# EasyEDA schematic OCC test LM339.json
TITLE: Sheet_1; REV: 1.0; Date: 2024-12-10; Sheet: 1/1; Drawn By: helmut-f; Company: Your Company
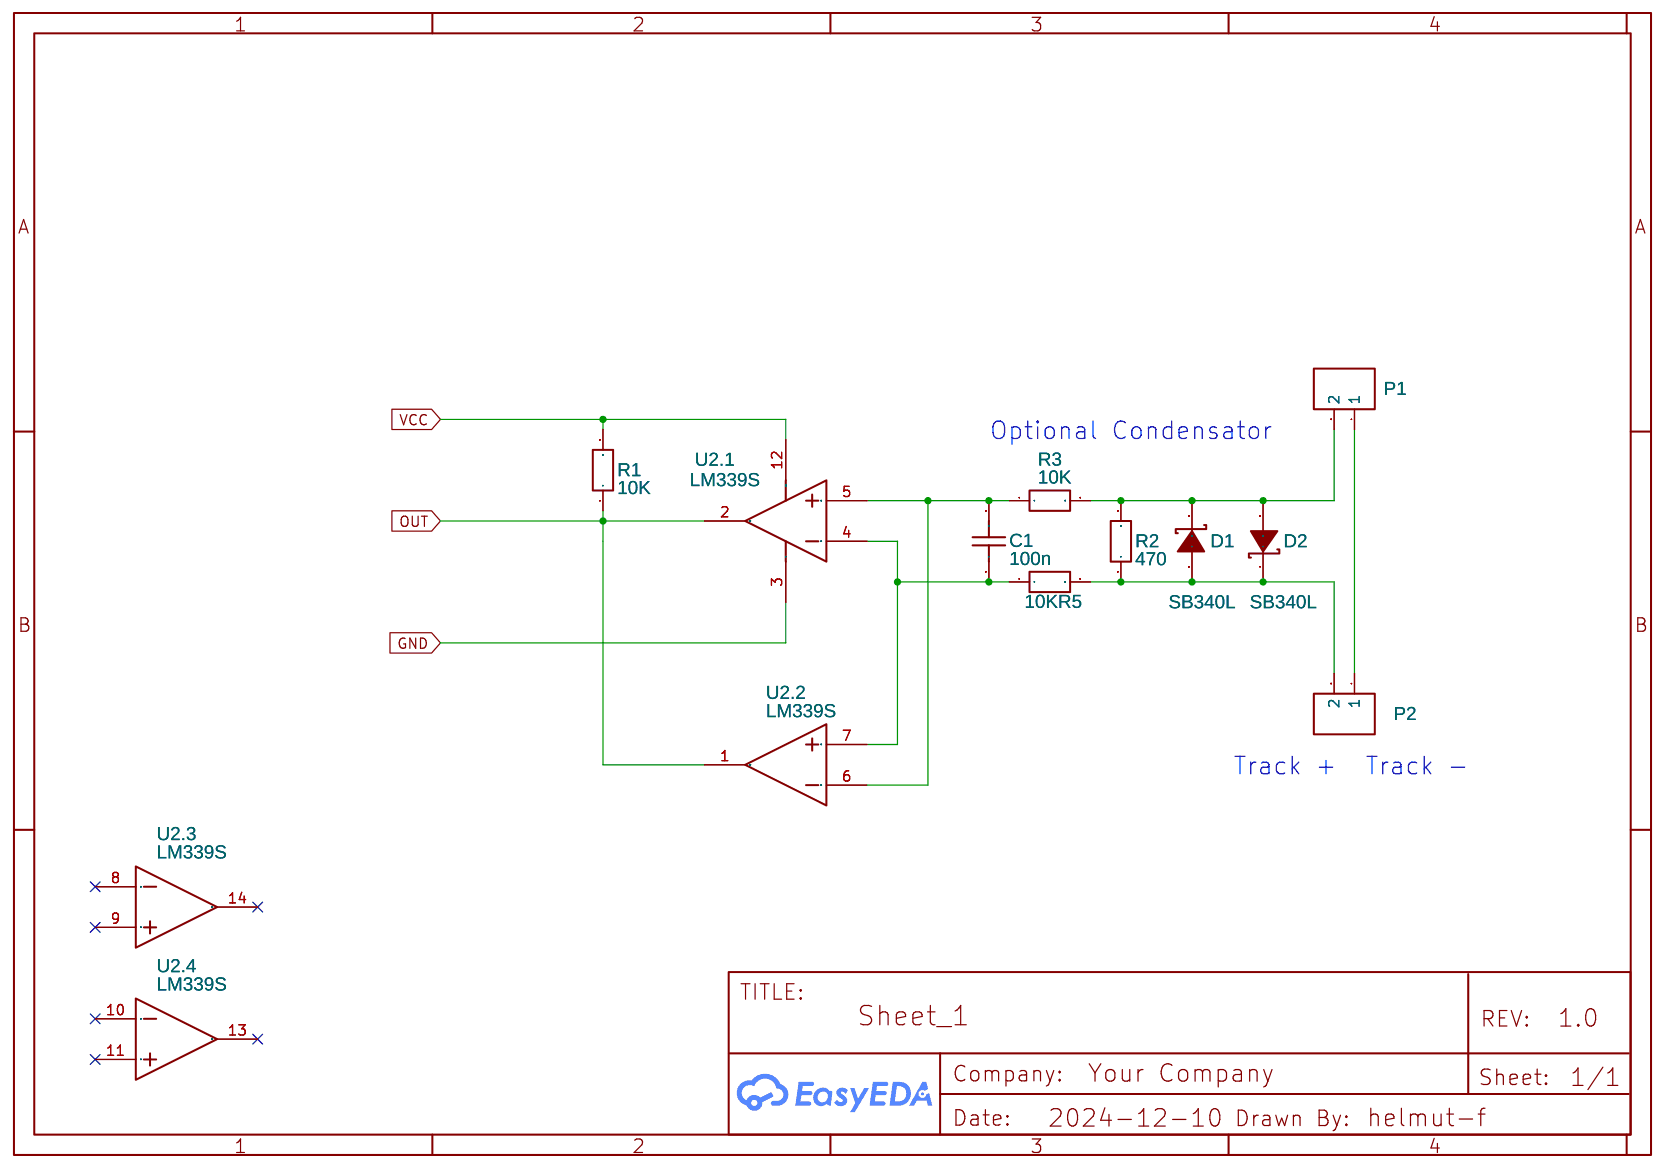
[diagram p0: schematic sheet]

## Parts
C1  100n  [RAD-0.1]
D1  SB340L  [DO-27_BD5.2-L8.9-P12.90-D1.5-RD]
D2  SB340L  [DO-27_BD5.2-L8.9-P12.90-D1.5-RD]
P1  CONN-TH_2P-P5.08  [CONN-TH_2P-P5.08]
P2  CONN-TH_2P-P5.08  [CONN-TH_2P-P5.08]
R1  10K  [R1206]
R2  470  [R1206]
R3  10K  [R1206]
R5  10K  [R1206]
U2  LM339S  [SOP-14_L8.8-W3.9-P1.27-LS6.0-BL]  (sections 1,2,3,4)

## Library data of the parts
C1 = C_RAD-0.1_US: Contributor: LCEDA_Lib
D1 D2 = SB340L: Contributor: LCSC; Supplier: LCSC; Supplier Part: C432802; Manufacturer: PINGWEI(平伟); JLCPCB Part Class: Extended Part
P1 P2 = CONN-TH_2P-P5.08: Supplier: LCSC; Contributor: LCEDA_Lib
R1-R3 R5 = R_1206_EU: Contributor: LCEDA_Lib
U2 = LM339S: Supplier: LCSC; Supplier Part: C19193841; Manufacturer: IDCHIP(英锐芯); subpart_no: 1

## Nets
GND: U2.3(V+)
VCC: R1.2 U2.12(GND)
OUT: R1.1 U2.1(OUT) U2.2(OUT)
Net-(C1-1): C1.1 R5.1 U2.4(IN-) U2.7(IN+)
Net-(C1-2): C1.2 R3.1 U2.5(IN+) U2.6(IN-)
Net-(D1-1): D1.1(K) D2.2(A) P1.2 R2.2 R3.2
Net-(D1-2): D1.2(A) D2.1(K) P2.2 R2.1 R5.2
Net-(P1-1): P1.1 P2.1

Not connected (* = marked no-connect by the designer): U2 8(IN-)* 9(IN+)* 10(IN-)* 11(IN+)* 13(OUT)* 14(OUT)*

## Notes on the sheet
- Optional Condensator
- Track +
- Track -
